# Altium project OdorGuard.PrjPcb
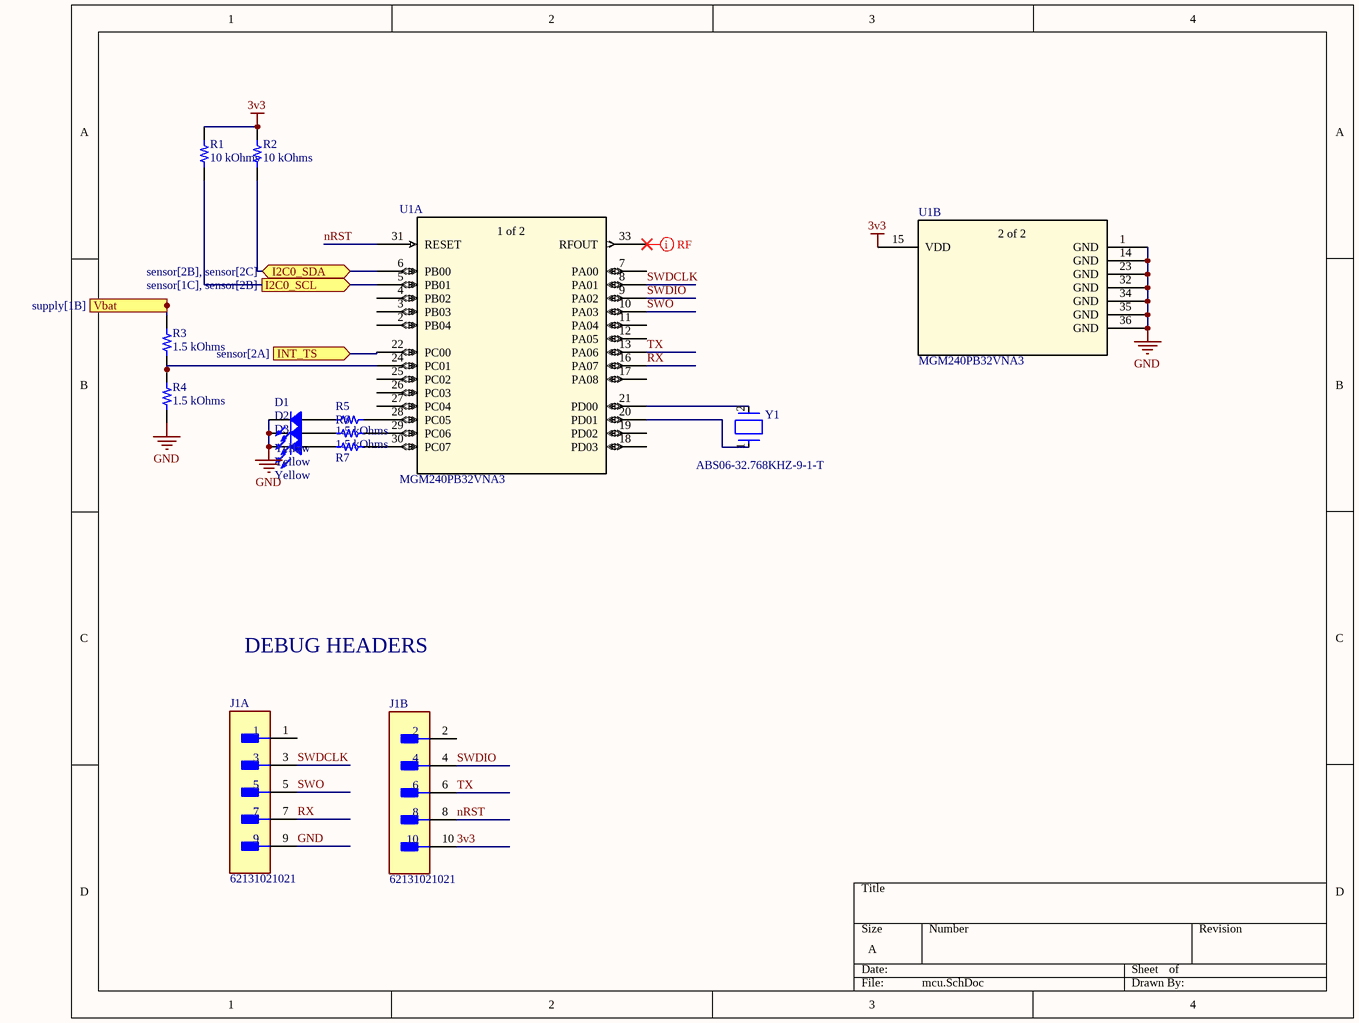
[diagram p0: mcu.SchDoc]
3 sheets, 25 parts. Net scope: flat (ports and power ports of the same name join across sheets).
Board file: PCB1.PcbDoc
Sheets:
  mcu.SchDoc
  supply.SchDoc
  sensor.SchDoc

## Sheet mcu.SchDoc
size A; SheetNumber: 1; SheetTotal: 3

### Parts
D1  Yellow  [LED 0402_1005 YELLOW]
D2  Yellow  [LED 0402_1005 YELLOW]
D3  Yellow  [LED 0402_1005 YELLOW]
J1  62131021021  [FP-62131021021-MFG]  (parts A,B of 2)
R1  10 kOhms  [RES 0402_1005]
R2  10 kOhms  [RES 0402_1005]
R3  1.5 kOhms  [RES 0402_1005]
R4  1.5 kOhms  [RES 0402_1005]
R5  1.5 kOhms  [RES 0402_1005]
R6  1.5 kOhms  [RES 0402_1005]
R7  (no value)  [RES 0402_1005]
U1  MGM240PB32VNA3  [xGM240P]  (parts A,B of 2)
Y1  ABS06-32.768KHZ-9-1-T  [FP-ABS06-MFG]

### Ports
I2C0_SCL (out, see sensor[1C], sensor[2B]), I2C0_SDA (bidir, see sensor[2B], sensor[2C]), INT_TS (in, see sensor[2A]), Vbat (see supply[1B])

### Nets
3v3: J1.10 R1.1 R2.1 U1.15(VDD)
GND: D1.2 D2.2 D3.2 J1.9 R4.2 U1.1(GND) U1.14(GND) U1.23(GND) U1.32(GND) U1.34(GND) U1.35(GND) U1.36(GND)
Vbat: R3.1 ; port Vbat
nRST: J1.8 U1.31(RESET)
RX: J1.7 U1.16(PA07)
SWDCLK: J1.3 U1.8(PA01)
SWDIO: J1.4 U1.9(PA02)
SWO: J1.5 U1.10(PA03)
TX: J1.6 U1.13(PA06)
NetD1_1: D1.1 R5.1
NetD2_1: D2.1 R6.1
NetD3_1: D3.1 R7.1
NetR1_2: R1.2 U1.5(PB01) ; port I2C0_SCL
NetR2_2: R2.2 U1.6(PB00) ; port I2C0_SDA
NetR3_2: R3.2 R4.1 U1.24(PC01)
NetR5_2: R5.2 U1.28(PC05)
NetR6_2: R6.2 U1.29(PC06)
NetR7_2: R7.2 U1.30(PC07)
NetU1_20: U1.20(PD01) Y1.1
NetU1_21: U1.21(PD00) Y1.2
NetU1_22: U1.22(PC00) ; port INT_TS

Not connected (* = marked no-connect by the designer): J1 1 2; U1 2(PB04) 3(PB03) 4(PB02) 7(PA00) 11(PA04) 12(PA05) 17(PA08) 18(PD03) 19(PD02) 25(PC02) 26(PC03) 27(PC04) 33(RFOUT)*

### Layout directives
mark named RF: NetU1_33

### Notes on the sheet
- DEBUG HEADERS
- (in symbol MGM240PB32VNA3, part A) 1 of 2
- (in symbol MGM240PB32VNA3, part B) 2 of 2

### Library data of the parts
D1-D3 = BL-HKC37A-AV-TRB: 0402 YELLOW; Manufacturer: American Bright Optoelectronics Corporation; Configuration: Standard; Current - Test: 20mA; Lens Color: Colorless; Lens Style: Rectangle with Flat Top; Lens Transparency: Clear; Millicandela Rating: 120mcd; Viewing Angle: 120°; Voltage - Forward (Vf) (Typ): 2.2V; Wavelength - Dominant: 589nm; Wavelength - Peak: 590nm; Part Number: BL-HKC37A-AV-TRB; Color: Yellow; ComponentLink1Description: Datasheet; ComponentLink1URL: https://americanbrightled.com/pdffiles/smt/BL-HKC37A-AV-TRB.pdf; ComponentLink2Description: DigiKey Link; ComponentLink2URL: https://www.digikey.com/en/products/detail/american-bright-optoelectronics-corporation/BL-HKC37A-AV-TRB/9678171; Device Package: 0402 (1005 Metric); Height (Max): 0.45mm; LastUpdated: 11/9/2022 10:29:51 am; Lifecycle Status: Active; Minimum Order: 1; Mounting Type: Surface Mount; Package / Case: 0402 (1005 Metric); Packaging: TapeAndReel; PartId: 1041; Part Status: Active; Price: 0.06; Series: -; Size / Dimension: 1.00mm L x 0.50mm W; Supplier 1: DigiKey; Supplier Part Number 1: BL-HKC37A-AV-TRBCT-ND; Supplier Device Package: 0402; Value: Yellow
J1 = CMP-1502-00938-2: 1.27mm SMT Straight Dual Pin Header WR-PHD; RoHS Compliant: Yes
R1 R2 R7 = ERA-2VRW1501X: RES 1.5K OHM 0.05% 1/10W 0402; Manufacturer: Panasonic Electronic Components; Power (Watts): 0.1W, 1/10W; Resistance: 1.5 kOhms; Temperature Coefficient: ±10ppm/°C; Part Number: ERA-2VRW1501X; ComponentLink1Description: Datasheet; ComponentLink1URL: https://api.pim.na.industrial.panasonic.com/file_stream/main/fileversion/9152; ComponentLink2Description: DigiKey Link; ComponentLink2URL: https://www.digikey.com/en/products/detail/panasonic-electronic-components/ERA-2VRW1501X/12086957; Composition: Thin Film; Device Package: 0402 (1005 Metric); Features: Anti-Sulfur, Automotive AEC-Q200; Height - Seated (Max): 0.016" (0.40mm); LastUpdated: 11/9/2022 9:53:08 am; Lifecycle Status: Active; Minimum Order: 1; Number of Terminations: 2; Operating Temperature: -55°C ~ 155°C; Package / Case: 0402 (1005 Metric); Packaging: TapeAndReel; PartId: 67400; Part Status: Active; Price: 0.24; Ratings: AEC-Q200; Series: ERA-2V; Size / Dimension: 0.039" L x 0.020" W (1.00mm x 0.50mm); Supplier 1: DigiKey; Supplier Part Number 1: 10-ERA-2VRW1501XCT-ND; Supplier Device Package: 0402; Tolerance: ±0.05%
  R1 R2: Value: 10 kOhms
R3-R6 = ERA-2VRW1501X: RES 1.5K OHM 0.05% 1/10W 0402; Manufacturer: Panasonic Electronic Components; Power (Watts): 0.1W, 1/10W; Temperature Coefficient: ±10ppm/°C; Part Number: ERA-2VRW1501X; Value: 1.5 kOhms; ComponentLink1Description: Datasheet; ComponentLink1URL: https://api.pim.na.industrial.panasonic.com/file_stream/main/fileversion/9152; ComponentLink2Description: DigiKey Link; ComponentLink2URL: https://www.digikey.com/en/products/detail/panasonic-electronic-components/ERA-2VRW1501X/12086957; Composition: Thin Film; Device Package: 0402 (1005 Metric); Features: Anti-Sulfur, Automotive AEC-Q200; Height - Seated (Max): 0.016" (0.40mm); LastUpdated: 11/9/2022 9:53:08 am; Lifecycle Status: Active; Minimum Order: 1; Number of Terminations: 2; Operating Temperature: -55°C ~ 155°C; Package / Case: 0402 (1005 Metric); Packaging: TapeAndReel; PartId: 67400; Part Status: Active; Price: 0.24; Ratings: AEC-Q200; Resistance: 1.5 kOhms; Series: ERA-2V; Size / Dimension: 0.039" L x 0.020" W (1.00mm x 0.50mm); Supplier 1: DigiKey; Supplier Part Number 1: 10-ERA-2VRW1501XCT-ND; Supplier Device Package: 0402; Tolerance: ±0.05%
U1 = MGM240PB32VNA3: No Description Available; Mfr_Name: Silicon Labs; RefDes: RefDes; Type: Type
Y1 = CMP-27762-003430-2: Crystal 32.768kHz ±10ppm (Tol) 9pF FUND 90kΩ 2-Pin Mini-CSMD T/R; Series Resistance: 90kR; Series: ABS06; Case/Package: CSMD; Package Quantity: 3000; Load Capacitance: 9pF; Number of Pins: 2; Tolerance: 10ppm; RoHS Compliant: Yes; Depth: 1.2mm; Termination: SMD/SMT; Min Operating Temperature: -40°C; Length: 2mm; Packaging: Tape and Reel; Max Operating Temperature: 85°C; Frequency Tolerance: 10ppm; Width: 1.2mm; ESR (Equivalent Series Resistance): 90kR; Radiation Hardening: No; Frequency: 32.768kHz; REACH SVHC: No SVHC; Mount: Surface Mount; Height: 0.6mm

## Sheet supply.SchDoc
size A; SheetNumber: 2; SheetTotal: 3
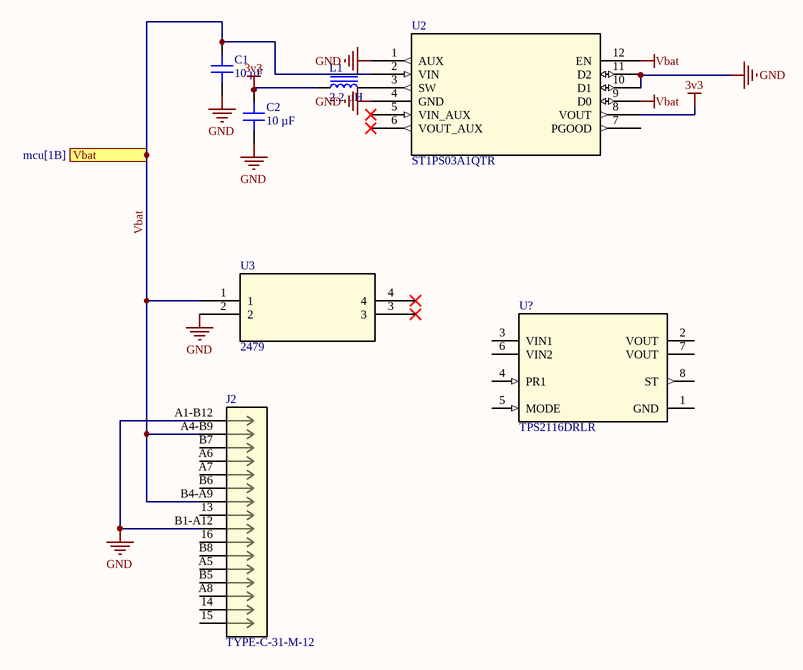
[diagram p1: supply.SchDoc]

### Parts
C1  10 µF  [CAP 0402_1005]
C2  10 µF  [CAP 0402_1005]
J2  TYPE-C-31-M-12  [CONN12_C-31-M-12_HRO]
L1  2.2 µH  [TDK VLS201612CX]
U2  ST1PS03A1QTR  [TQFN12_2X1P7_STM]
U3  2479  [2479PCB_37P49X52P63_KEY]
U?  TPS2116DRLR  [DRL0008A-MFG]

### Ports
Vbat (see mcu[1B])

### Nets
3v3: C2.1 L1.1 U2.8(VOUT)
GND: C1.2 C2.2 J2.A1-B12 J2.B1-A12 U2.1(AUX) U2.4(GND) U2.10(D1) U2.11(D2) U3.2
Vbat: C1.1 J2.A4-B9 J2.B4-A9 U2.2(VIN) U2.9(D0) U2.12(EN) U3.1 ; port Vbat
NetL1_2: L1.2 U2.3(SW)

Not connected (* = marked no-connect by the designer): J2 13 14 15 16 A5 A6 A7 A8 B5 B6 B7 B8; U2 5(VIN_AUX)* 6(VOUT_AUX)* 7(PGOOD); U3 3* 4*; U? 1(GND) 2(VOUT) 3(VIN1) 4(PR1) 5(MODE) 6(VIN2) 7(VOUT) 8(ST)

### Library data of the parts
C1 C2 = C0402C104K7PAC7867: CAP CER 0.1UF 4V X5R 0402; manufacturer: KEMET; Capacitance: 0.1 µF; Tolerance: ±10%; Part Number: C0402C104K7PAC7867; Value: 10 µF; Applications: Bypass, Decoupling; componentlink1description: Datasheet; componentlink1url: https://api.kemet.com/component-edge/download/datasheet/C0402C104K7PAC7867.pdf; componentlink2description: DigiKey Link; componentlink2url: https://www.digikey.com/en/products/detail/kemet/C0402C104K7PAC7867/7381987; Device Package: 0402 (1005 Metric); lastupdated: 1/9/2022 12:30:40 pm; Lifecycle Status: Active; Minimum Order: 1; Mounting Type: Surface Mount, MLCC; Operating Temperature: -55°C ~ 85°C; Package / Case: 0402 (1005 Metric); packaging: TapeAndReel; partid: 5603; Part Status: Active; price: 0.01; series: SMD Comm X5R; Size / Dimension: 0.039" L x 0.020" W (1.00mm x 0.50mm); Supplier 1: DigiKey; Supplier Part Number 1: 399-14871-1-ND; Temperature Coefficient: X5R; Thickness (Max): 0.022" (0.55mm); Voltage - Rated: 4V
J2 = TYPE-C-31-M-12: No Description Available; Mfr_Name: HRO Electronics; RefDes: RefDes; Type: Type
L1 = VLS201612CX-6R8M-1: FIXED IND 6.8UH 930MA 368MOHM SM; Manufacturer: TDK Corporation; Current - Saturation: 730mA; DC Resistance (DCR): 368mOhm Max; Inductance: 6.8 µH; Inductance Frequency - Test: 1 MHz; Material - Core: Ferrite; Shielding: Shielded; Tolerance: ±20%; Type: Drum Core, Wirewound; Part Number: VLS201612CX-6R8M-1; ComponentLink1Description: Datasheet; ComponentLink1URL: https://product.tdk.com/info/en/catalog/datasheets/inductor_commercial_power_vls201612cx-1_en.pdf?ref_disty=digikey; ComponentLink2Description: DigiKey Link; ComponentLink2URL: https://www.digikey.com/en/products/detail/tdk-corporation/VLS201612CX-6R8M-1/5169771; Current Rating (Amps): 930 mA; Device Package: Nonstandard; Height - Seated (Max): 0.047" (1.20mm); LastUpdated: 11/9/2022 10:31:03 am; Lifecycle Status: Active; Minimum Order: 1; Mounting Type: Surface Mount; Operating Temperature: -40°C ~ 105°C; Package / Case: Nonstandard; Packaging: TapeAndReel; PartId: 207; Part Status: Active; Price: 0.13; Series: VLS-CX-1; Size / Dimension: 0.079" L x 0.063" W (2.00mm x 1.60mm); Supplier 1: DigiKey; Supplier Part Number 1: 445-172966-1-ND; Supplier Device Package: 2016; Value: 2.2 µH
U2 = ST1PS03A1QTR: No Description Available; Mfr_Name: STMicroelectronics; RefDes: RefDes; Type: Type
U3 = 2479: No Description Available; Mfr_Name: Keystone Electronics; RefDes: RefDes; Type: Type
U? = TPS2116DRLR: No Description Available; Mfr_Name: Texas Instruments; TYPE: TYPE; RefDes: RefDes

## Sheet sensor.SchDoc
size A; SheetNumber: 3; SheetTotal: 3
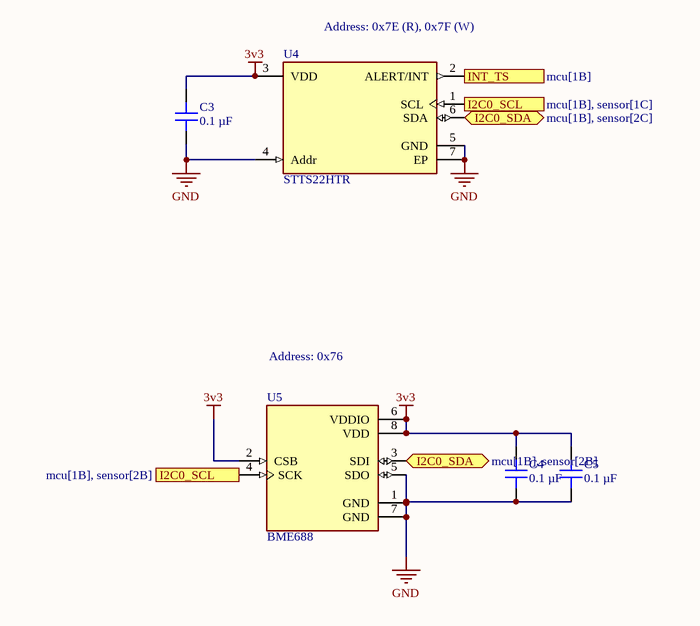
[diagram p2: sensor.SchDoc]

### Parts
C3  0.1 µF  [CAP 0402_1005]
C4  0.1 µF  [CAP 0402_1005]
C5  0.1 µF  [CAP 0402_1005]
U4  STTS22HTR  [FP-UDFN-6L-DM00423052-MFG]
U5  BME688  [IC_BME688]

### Ports
I2C0_SCL (in, see mcu[1B], sensor[1C]), I2C0_SCL (in, see mcu[1B], sensor[2B]), I2C0_SDA (bidir, see mcu[1B], sensor[2B]), I2C0_SDA (bidir, see mcu[1B], sensor[2C]), INT_TS (out, see mcu[1B])

### Nets
3v3: C3.2 C4.2 C5.2 U4.3(VDD) U5.2(CSB) U5.6(VDDIO) U5.8(VDD)
GND: C3.1 C4.1 C5.1 U4.4(Addr) U4.5(GND) U4.7(EP) U5.1(GND) U5.5(SDO) U5.7(GND)
NetR1_2: U4.1(SCL) U5.4(SCK) ; port I2C0_SCL
NetR2_2: U4.6(SDA) U5.3(SDI) ; port I2C0_SDA
NetU1_22: U4.2(ALERT/INT) ; port INT_TS

### Notes on the sheet
- (near U4) Address: 0x7E (R), 0x7F (W)
- (near U5) Address: 0x76

### Library data of the parts
C3-C5 = C0402C104K7PAC7867: CAP CER 0.1UF 4V X5R 0402; manufacturer: KEMET; Tolerance: ±10%; Part Number: C0402C104K7PAC7867; Value: 0.1 µF; Applications: Bypass, Decoupling; Capacitance: 0.1 µF; componentlink1description: Datasheet; componentlink1url: https://api.kemet.com/component-edge/download/datasheet/C0402C104K7PAC7867.pdf; componentlink2description: DigiKey Link; componentlink2url: https://www.digikey.com/en/products/detail/kemet/C0402C104K7PAC7867/7381987; Device Package: 0402 (1005 Metric); lastupdated: 1/9/2022 12:30:40 pm; Lifecycle Status: Active; Minimum Order: 1; Mounting Type: Surface Mount, MLCC; Operating Temperature: -55°C ~ 85°C; Package / Case: 0402 (1005 Metric); packaging: TapeAndReel; partid: 5603; Part Status: Active; price: 0.01; series: SMD Comm X5R; Size / Dimension: 0.039" L x 0.020" W (1.00mm x 0.50mm); Supplier 1: DigiKey; Supplier Part Number 1: 399-14871-1-ND; Temperature Coefficient: X5R; Thickness (Max): 0.022" (0.55mm); Voltage - Rated: 4V
U4 = CMP-12184-000002-1: LOW-VOLTAGE, ULTRA-LOW-POWER, 0.; Manufacturer: STMicroelectronics; Max Supply Voltage: 3.6V; Sensor Output: I2C,SMBus; Min Supply Voltage: 1.5V; Resolution: 16bits; Standoff Height: 0mm; Operating Supply Current: 1.75-120uA; Octopart: https://octopart.com/stts22htr-stmicroelectronics-103417944; Temperature: -40°C to +125°C; Interface: I2C,SMBus; ComponentLink2Description: Datasheet; Device Class L3: unset; Lead Free: Yes; Temperature Range Low: -40°C; ComponentLink2URL: https://www.st.com/resource/en/datasheet/stts22h.pdf; Temperature Range High: +125°C; RoHS: TRUE; Automotive: No; Device Class L1: Sensors; Category: IC; Manufacturer Part Number: STTS22HTR; Package: UDFN-6L-DM00423052; Device Class L2: Temperature and Humidity Sensors; Mouser Description: Low-voltage, ultra-low-power, 0.5 ï¿½C accuracy Iï¿½C/SMBus 3.0 temperature sensor; Digikey Description: LOW-VOLTAGE, ULTRA-LOW-POWER, 0.; Height: 0.55mm
U5 = BME688: Gas sensor measuring relative humidity, barometric pressure, ambient temperature and gas (VOC); Package: None; MP: BME688; Price: None; Availability: Unavailable; Value: *

## Nets that join several sheets
3v3: mcu (J1.10 R1.1 R2.1 U1.15), supply (C2.1 L1.1 U2.8), sensor (7 pins)
GND: mcu (12 pins), supply (9 pins), sensor (9 pins)
Vbat: mcu (R3.1), supply (7 pins)
NetR1_2: mcu (R1.2 U1.5), sensor (U4.1 U5.4)
NetR2_2: mcu (R2.2 U1.6), sensor (U4.6 U5.3)
NetU1_22: mcu (U1.22), sensor (U4.2)